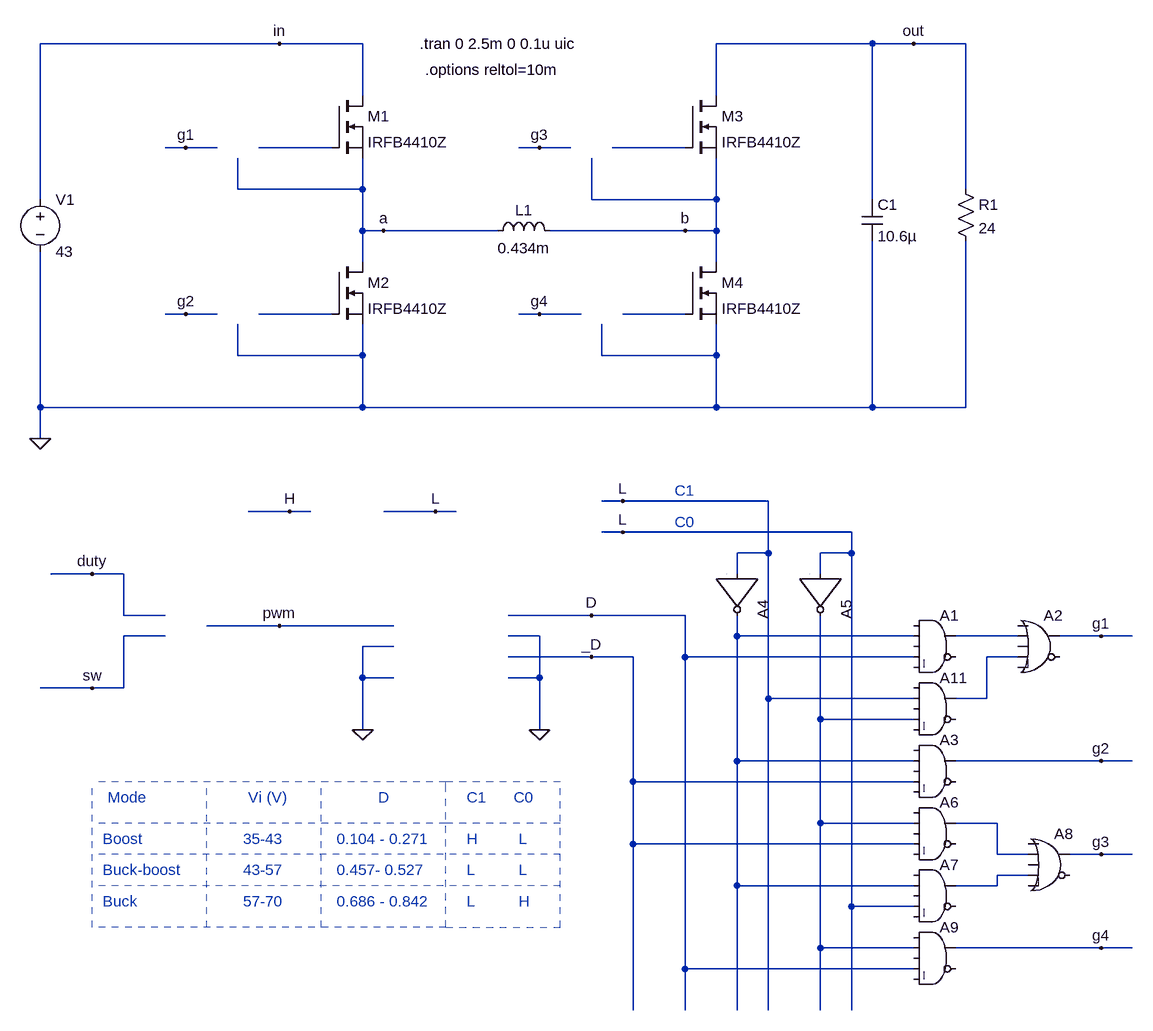
[diagram p0: schematic 1.- 4-Switch-buck-boost.asc]
1.- 4-Switch-buck-boost.asc, the LTspice schematic file:
Version 4.1
SHEET 1 1924 1444
WIRE 336 -160 -32 -160
WIRE 464 -160 336 -160
WIRE 1248 -160 1008 -160
WIRE 1312 -160 1248 -160
WIRE 1392 -160 1312 -160
WIRE 464 -80 464 -160
WIRE 1008 -80 1008 -160
WIRE 192 0 160 0
WIRE 240 0 192 0
WIRE 416 0 304 0
WIRE 736 0 704 0
WIRE 784 0 736 0
WIRE 960 0 848 0
WIRE 272 64 272 16
WIRE 464 64 464 16
WIRE 464 64 272 64
WIRE 1392 64 1392 -160
WIRE -32 80 -32 -160
WIRE 816 80 816 16
WIRE 1008 80 1008 16
WIRE 1008 80 816 80
WIRE 1248 80 1248 -160
WIRE 464 128 464 64
WIRE 496 128 464 128
WIRE 672 128 496 128
WIRE 960 128 752 128
WIRE 1008 128 1008 80
WIRE 1008 128 960 128
WIRE 464 176 464 128
WIRE 1008 176 1008 128
WIRE 192 256 160 256
WIRE 240 256 192 256
WIRE 416 256 304 256
WIRE 736 256 704 256
WIRE 800 256 736 256
WIRE 960 256 864 256
WIRE 272 320 272 272
WIRE 464 320 464 272
WIRE 464 320 272 320
WIRE 832 320 832 272
WIRE 1008 320 1008 272
WIRE 1008 320 832 320
WIRE -32 400 -32 160
WIRE 464 400 464 320
WIRE 464 400 -32 400
WIRE 1008 400 1008 320
WIRE 1008 400 464 400
WIRE 1248 400 1248 144
WIRE 1248 400 1008 400
WIRE 1392 400 1392 144
WIRE 1392 400 1248 400
WIRE -32 448 -32 400
WIRE 864 544 832 544
WIRE 1088 544 864 544
WIRE 352 560 288 560
WIRE 384 560 352 560
WIRE 576 560 496 560
WIRE 608 560 576 560
WIRE 864 592 832 592
WIRE 1216 592 864 592
WIRE 1088 624 1088 544
WIRE 1088 624 1040 624
WIRE 1216 624 1216 592
WIRE 1216 624 1168 624
WIRE 48 656 -16 656
WIRE 96 656 48 656
WIRE 1040 656 1040 624
WIRE 1168 656 1168 624
WIRE 96 720 96 656
WIRE 160 720 96 720
WIRE 816 720 688 720
WIRE 960 720 816 720
WIRE 336 736 224 736
WIRE 512 736 336 736
WIRE 160 752 96 752
WIRE 736 752 688 752
WIRE 1040 752 1040 720
WIRE 1312 752 1040 752
WIRE 1472 752 1376 752
WIRE 1600 752 1536 752
WIRE 1648 752 1600 752
WIRE 512 768 464 768
WIRE 816 784 688 784
WIRE 880 784 816 784
WIRE 960 784 960 720
WIRE 1312 784 960 784
WIRE 1472 784 1424 784
WIRE 464 816 464 768
WIRE 512 816 464 816
WIRE 736 816 736 752
WIRE 736 816 688 816
WIRE 48 832 -32 832
WIRE 96 832 96 752
WIRE 96 832 48 832
WIRE 1088 848 1088 624
WIRE 1312 848 1088 848
WIRE 1424 848 1424 784
WIRE 1424 848 1376 848
WIRE 1168 880 1168 720
WIRE 1312 880 1168 880
WIRE 464 896 464 816
WIRE 736 896 736 816
WIRE 1040 944 1040 752
WIRE 1312 944 1040 944
WIRE 1600 944 1376 944
WIRE 1648 944 1600 944
WIRE 880 976 880 784
WIRE 1312 976 880 976
WIRE 1168 1040 1168 880
WIRE 1312 1040 1168 1040
WIRE 1440 1040 1376 1040
WIRE 880 1072 880 976
WIRE 1312 1072 880 1072
WIRE 1440 1088 1440 1040
WIRE 1488 1088 1440 1088
WIRE 1600 1088 1552 1088
WIRE 1648 1088 1600 1088
WIRE 1488 1120 1440 1120
WIRE 1040 1136 1040 944
WIRE 1312 1136 1040 1136
WIRE 1440 1136 1440 1120
WIRE 1440 1136 1376 1136
WIRE 1216 1168 1216 624
WIRE 1312 1168 1216 1168
WIRE 1168 1232 1168 1040
WIRE 1312 1232 1168 1232
WIRE 1600 1232 1376 1232
WIRE 1648 1232 1600 1232
WIRE 960 1264 960 784
WIRE 1312 1264 960 1264
WIRE 880 1328 880 1072
WIRE 960 1328 960 1264
WIRE 1040 1328 1040 1136
WIRE 1088 1328 1088 848
WIRE 1168 1328 1168 1232
WIRE 1216 1328 1216 1168
FLAG -32 448 0
FLAG 48 832 sw
FLAG 48 656 duty
FLAG 336 736 pwm
FLAG 336 -160 in
FLAG 1312 -160 out
FLAG 496 128 a
FLAG 960 128 b
FLAG 464 896 0
FLAG 736 896 0
FLAG 816 720 D
FLAG 816 784 _D
FLAG 192 0 g1
FLAG 192 256 g2
FLAG 736 0 g3
FLAG 736 256 g4
FLAG 1600 752 g1
FLAG 1600 944 g2
FLAG 1600 1088 g3
FLAG 1600 1232 g4
FLAG 352 560 H
FLAG 576 560 L
FLAG 864 544 L
FLAG 864 592 L
SYMBOL nmos 416 -80 R0
SYMATTR InstName M1
SYMATTR Value IRFB4410Z
SYMBOL nmos 416 176 R0
SYMATTR InstName M2
SYMATTR Value IRFB4410Z
SYMBOL nmos 960 -80 R0
SYMATTR InstName M3
SYMATTR Value IRFB4410Z
SYMBOL nmos 960 176 R0
SYMATTR InstName M4
SYMATTR Value IRFB4410Z
SYMBOL voltage -32 64 R0
WINDOW 123 0 0 Left 0
WINDOW 39 0 0 Left 0
SYMATTR InstName V1
SYMATTR Value 43
SYMBOL ind 656 144 R270
WINDOW 0 32 56 VTop 2
WINDOW 3 5 56 VBottom 2
SYMATTR InstName L1
SYMATTR Value 0.434m
SYMBOL cap 1232 80 R0
SYMATTR InstName C1
SYMATTR Value 10.6µ
SYMBOL res 1376 48 R0
SYMATTR InstName R1
SYMATTR Value 24
SYMBOL Digital\\and 1344 704 R0
SYMATTR InstName A1
SYMBOL Digital\\or 1504 704 R0
SYMATTR InstName A2
SYMBOL Digital\\inv 1104 656 R90
SYMATTR InstName A4
SYMBOL Digital\\inv 1232 656 R90
SYMATTR InstName A5
SYMBOL Digital\\and 1344 896 R0
SYMATTR InstName A3
SYMBOL Digital\\and 1344 992 R0
SYMATTR InstName A6
SYMBOL Digital\\or 1520 1040 R0
SYMATTR InstName A8
SYMBOL Digital\\and 1344 1184 R0
SYMATTR InstName A9
SYMBOL Digital\\and 1344 1088 R0
SYMATTR InstName A7
SYMBOL Digital\\and 1344 800 R0
SYMATTR InstName A11
TEXT 552 -160 Left 2 !.tran 0 2.5m 0 0.1u uic
TEXT 560 -120 Left 2 !.options reltol=10m
TEXT 944 528 Left 2 ;C1
TEXT 944 576 Left 2 ;C0
TEXT 288 1000 Left 2 ;Vi (V)
TEXT 488 1000 Left 2 ;D
TEXT 72 1000 Left 2 ;Mode
TEXT 64 1064 Left 2 ;Boost
TEXT 280 1064 Left 2 ;35-43
TEXT 424 1064 Left 2 ;0.104 - 0.271
TEXT 64 1112 Left 2 ;Buck-boost
TEXT 280 1112 Left 2 ;43-57
TEXT 424 1112 Left 2 ;0.457- 0.527
TEXT 64 1160 Left 2 ;Buck
TEXT 280 1160 Left 2 ;57-70
TEXT 424 1160 Left 2 ;0.686 - 0.842
TEXT 624 1000 Left 2 ;C1
TEXT 696 1000 Left 2 ;C0
TEXT 624 1064 Left 2 ;H
TEXT 704 1064 Left 2 ;L
TEXT 624 1160 Left 2 ;L
TEXT 704 1160 Left 2 ;H
TEXT 624 1112 Left 2 ;L
TEXT 704 1112 Left 2 ;L
LINE Normal 592 1040 48 1040 2
LINE Normal 592 1200 48 1200 2
LINE Normal 592 1200 592 992 2
LINE Normal 592 976 48 976 2
LINE Normal 592 992 592 976 2
LINE Normal 48 1200 48 976 2
LINE Normal 224 1200 224 976 2
LINE Normal 400 1200 400 976 2
LINE Normal 768 976 592 976 2
LINE Normal 768 1200 768 976 2
LINE Normal 592 1200 768 1200 2
LINE Normal 768 1040 592 1040 2
LINE Normal 768 1088 48 1088 2
LINE Normal 768 1136 48 1136 2

The netlist it stands for:
* 1.- 4-Switch-buck-boost.asc
M1 in N001 a a IRFB4410Z
M2 a N003 0 0 IRFB4410Z
M3 out N002 b b IRFB4410Z
M4 b N004 0 0 IRFB4410Z
V1 in 0 43
L1 a b 0.434m
C1 out 0 10.6µ
R1 out 0 24
A1 0 N005 0 D 0 0 N006 0 AND
A2 0 N006 0 N007 0 0 g1 0 OR
A4 L 0 0 0 0 N005 0 0 BUF
A5 L 0 0 0 0 N008 0 0 BUF
A3 0 N005 0 _D 0 0 g2 0 AND
A6 0 N008 0 _D 0 0 N009 0 AND
A8 0 N009 0 N010 0 0 g3 0 OR
A9 0 N008 0 D 0 0 g4 0 AND
A7 0 N005 0 L 0 0 N010 0 AND
A11 0 L 0 N008 0 0 N007 0 AND
.model NMOS NMOS
.model PMOS PMOS
.lib standard.mos
.tran 0 2.5m 0 0.1u uic
.options reltol=10m
* C1
* C0
* Vi (V)
* D
* Mode
* Boost
* 35-43
* 0.104 - 0.271
* Buck-boost
* 43-57
* 0.457- 0.527
* Buck
* 57-70
* 0.686 - 0.842
* C1
* C0
* H
* L
* L
* H
* L
* L
.backanno
.end